# EAGLE schematic Esquema_v21 (EAGLE 9.7.0)
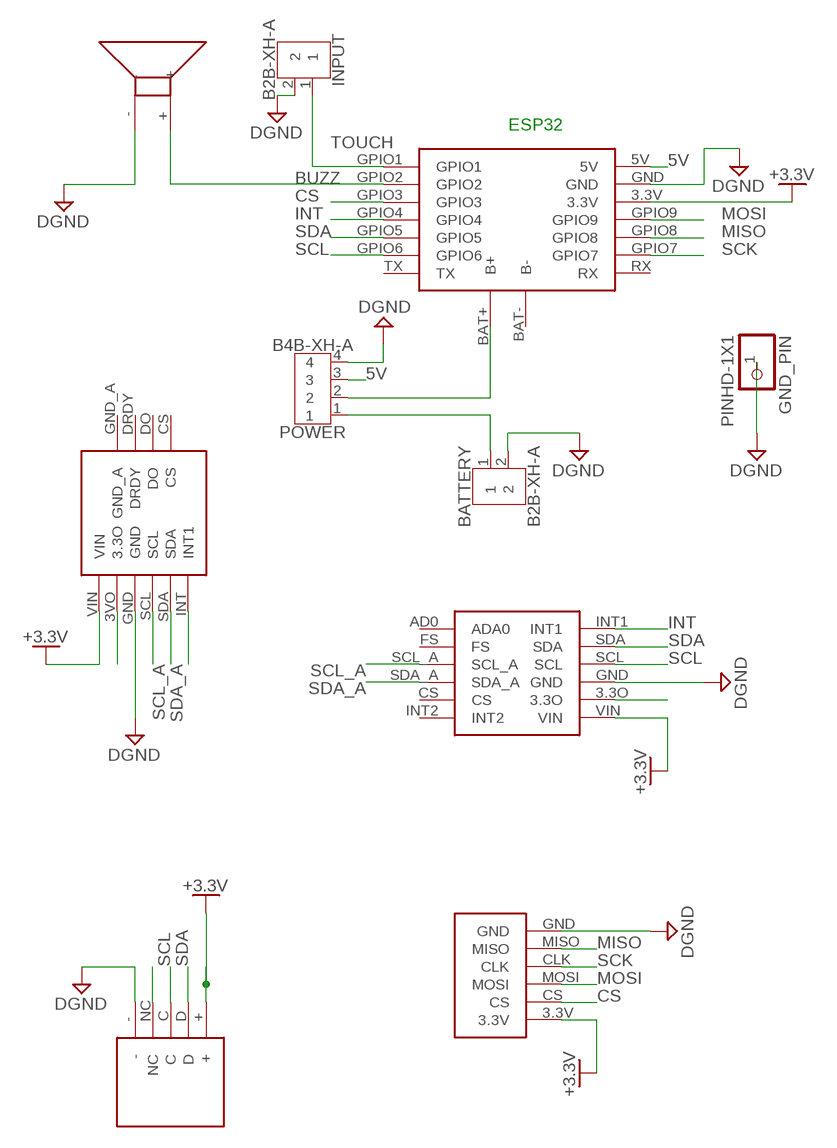
[diagram p0: schematic, sheet 1]

## Parts
BATTERY  B2B-XH-A  [B2B-XH-A]
GND_PIN  PINHD-1X1  [1X01]
INPUT  B2B-XH-A  [B2B-XH-A]
POWER  B4B-XH-A  [B4B-XH-A]
U$1  LIS3MDL  [LIS3MDL]
U$2  ICM20649  [ICM20649]
U$3  ESP32_SEEED_THP  [ESP32_SEEED_THP]
U$4  DS3231_RPI  [DS3231_RPI]
U$5  MICROSD_READER  [MICROSD_READER]
U$6  BUZZER  [BUZZER]

## Nets
5V: POWER.3 U$3.5V
+3.3V: U$1.VIN U$2.VIN U$3.3.3V U$4.+ U$5.3.3V
BUZZ: U$3.GPIO2 U$6.+
CS: U$3.GPIO3 U$5.CS
DGND: BATTERY.2 GND_PIN.1 INPUT.2 POWER.4 U$1.GND U$2.GND U$3.GND U$4.- U$5.GND U$6.-
INT: U$2.INT1 U$3.GPIO4
MISO: U$3.GPIO8 U$5.MISO
MOSI: U$3.GPIO9 U$5.MOSI
N$1: BATTERY.1 POWER.1
N$2: U$4.NC
N$3: POWER.2 U$3.BAT+(B+)
N$11: U$2.3.3O
N$17: U$1.3VO(3.3O)
N$21: U$1.INT(INT1)
SCK: U$3.GPIO7 U$5.CLK
SCL: U$2.SCL U$3.GPIO6 U$4.C
SCL_A: U$1.SCL U$2.SCL_A
SDA: U$2.SDA U$3.GPIO5 U$4.D
SDA_A: U$1.SDA U$2.SDA_A
TOUCH: INPUT.1 U$3.GPIO1
Unconnected: U$1.CS U$1.DO U$1.DRDY U$1.GND_A U$2.AD0(ADA0) U$2.CS U$2.FS U$2.INT2 U$3.BAT-(B-) U$3.RX U$3.TX

## Notes on the sheet
- ESP32

## Library data of the parts
BATTERY INPUT = Connector:B2B-XH-A: XH Connector Top Entry - 2POS Details see: Datasheet <http://www.jst-mfg.com/product/pdf/eng/eXH.pdf>; CATEGORY: Header; DATASHEET: https://www.jst-mfg.com/product/pdf/eng/eXH.pdf?67404de0bbae1; DESCRIPTION: Connector Header Through Hole 2 position 0.098" (2.50mm); MANUFACTURER: JST Sales America Inc.; MPN: B2B-XH-A; OPERATING_TEMPERATURE: -25°C ~ 85°C; PACKAGE_SIZE: NA; PACKAGE_TYPE: THT; PART_STATUS: ACTIVE; PITCH: 0.098" (2.50mm); ROHS: COMPLIANT; SERIES: XH; SUBCATEGORY: Rectangular Connectors; TYPE: Header-Male Pin-Board to Cable/Wire-Through Hole
GND_PIN = Connector:PINHD-1X1: PIN HEADER; CATEGORY: Headers; DESCRIPTION: Header-Straight-1 Position; PACKAGE_TYPE: THT; PITCH: 0.100" (2.54mm); SUBCATEGORY: Headers-Male Pins; TYPE: Board to Board or Cable-Unshrouded-Through Hole-Straight
POWER = Connector:B4B-XH-A: XH Connector Top Entry - 4POS Details see: Datasheet <http://www.jst-mfg.com/product/pdf/eng/eXH.pdf>; CATEGORY: Header; DATASHEET: https://www.jst-mfg.com/product/pdf/eng/eXH.pdf?67404de0bbae1; DESCRIPTION: Connector Header Through Hole 4 position 0.098" (2.50mm); MANUFACTURER: JST Sales America Inc.; MPN: B4B-XH-A; OPERATING_TEMPERATURE: -25°C ~ 85°C; PACKAGE_SIZE: NA; PACKAGE_TYPE: THT; PART_STATUS: ACTIVE; PITCH: 0.098" (2.50mm); ROHS: COMPLIANT; SERIES: XH; SUBCATEGORY: Rectangular Connectors; TYPE: Header-Male Pin-Board to Cable/Wire-Through Hole
U$1 = javelinLib:LIS3MDL
U$2 = javelinLib:ICM20649
U$3 = javelinLib:ESP32_SEEED_THP
U$4 = javelinLib:DS3231_RPI
U$5 = javelinLib:MICROSD_READER
U$6 = javelinLib:BUZZER